# EAGLE design usb (EAGLE 4.16)
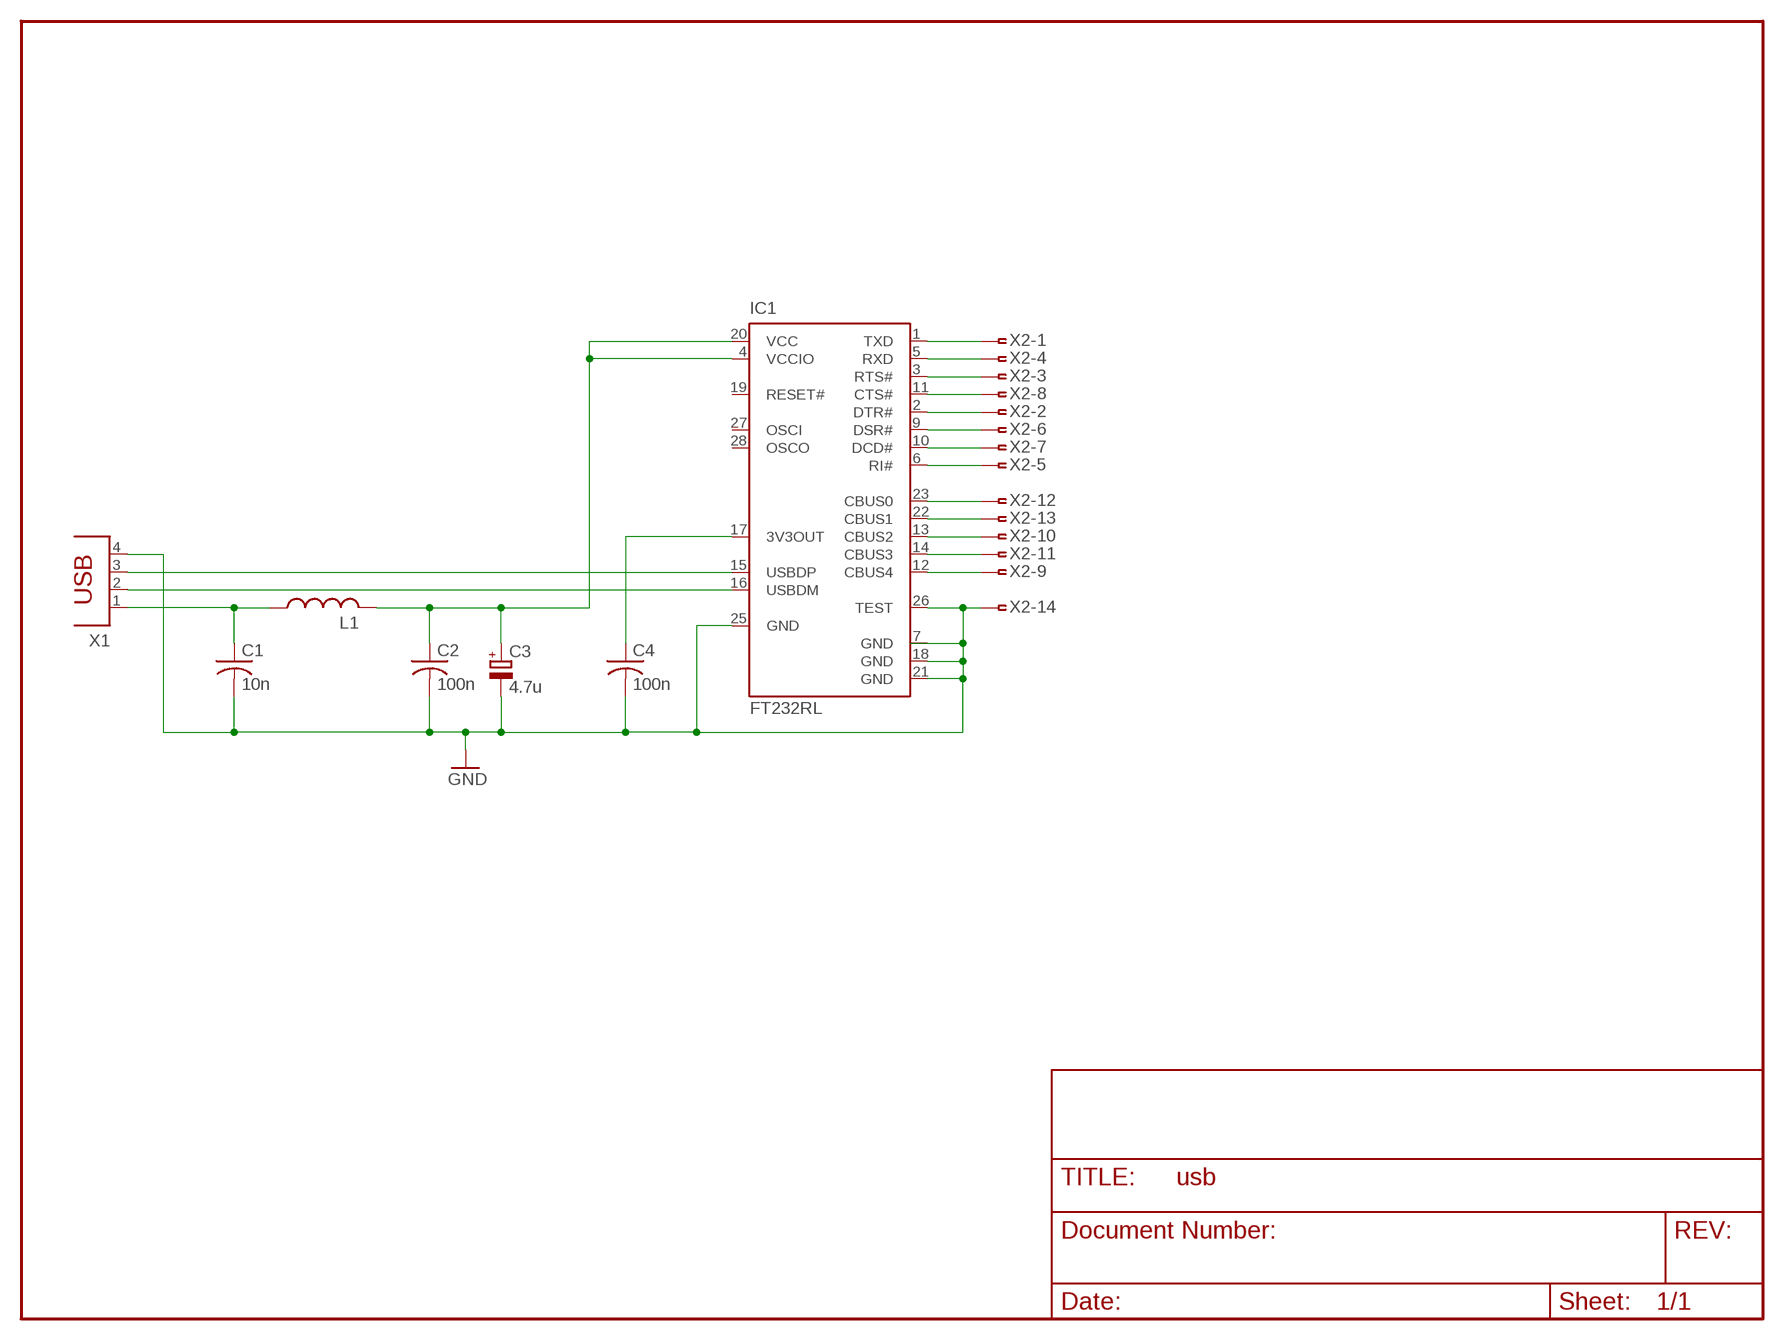
[diagram p0: schematic, sheet 1]

## Parts
C1  10n  C-USC0805  [C0805]
C2  100n  C-USC0805  [C0805]
C3  4.7u  CPOL-EUE2,5-6E  [E2,5-6E]
C4  100n  C-USC0805  [C0805]
IC1  FT232RL  [SSOP28]
L1  L-US0204V  [0204V]
X1  PN87520  [PN87520]
X2  FTOP-14  [FTOP-14]

## Nets
3.3V: C4.1 IC1.17(3V3OUT)
DCD: IC1.10(DCD#) X2.7
DSR: IC1.9(DSR#) X2.6
GND: C1.2 C2.2 C3.- C4.2 IC1.7(GND) IC1.18(GND) IC1.21(GND) IC1.25(GND) IC1.26(TEST) X1.4 X2.14
N$1: IC1.16(USBDM) X1.2
N$2: IC1.15(USBDP) X1.3
N$3: IC1.23(CBUS0) X2.12
N$5: C1.1 L1.1 X1.1
N$7: IC1.22(CBUS1) X2.13
N$8: IC1.13(CBUS2) X2.10
N$9: IC1.14(CBUS3) X2.11
N$10: IC1.12(CBUS4) X2.9
N$11: IC1.11(CTS#) X2.8
N$12: IC1.5(RXD) X2.4
N$13: IC1.6(RI#) X2.5
N$14: IC1.2(DTR#) X2.2
RTS: IC1.3(RTS#) X2.3
TXD: IC1.1(TXD) X2.1
VCC: C2.1 C3.+ IC1.4(VCCIO) IC1.20(VCC) L1.2
Unconnected: IC1.19(RESET#) IC1.27(OSCI) IC1.28(OSCO)

## Library data of the parts
C1 C2 C4 = rcl:C-US: CAPACITOR, American symbol
C3 = rcl:CPOL-EU: POLARIZED CAPACITOR, European symbol
IC1 = ftdichip:FT232R: Source: http://www.ftdichip.com/Documents/DataSheets/DS_FT232R_v104.pdf
L1 = rcl:L-US: INDUCTOR, American symbol
X1 = con-berg:PN87520: BERG USB connector
X2 = con-amp:FTOP-14: AMP connector

## Board
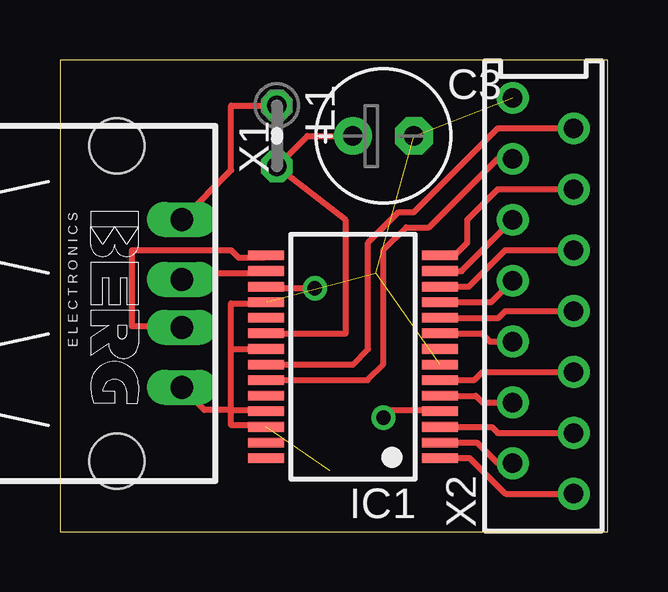
[diagram p1: board, top side]
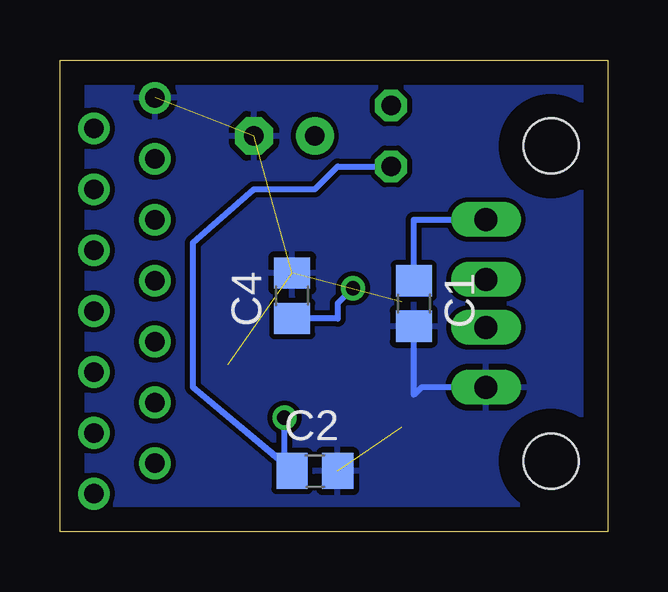
[diagram p2: board, bottom side, seen from below]

Size 22.85 x 19.67 mm. Coordinates in mm from the lower left corner, seen from the top.
Outline: 0,0 22.85,0 22.85,19.67 0,19.67 0,0
Copper layers (1*16): Top 0.035mm / dielectric 1.5mm / Bottom 0.035mm
Design rules "default": minimum track width 10mil, minimum drill 24mil, track to track 8mil, track to pad 8mil, pad to pad 8mil, via to via 8mil, smd to smd 8mil, copper to edge 40mil, drill to drill 8mil, minimum pad ring 10mil, minimum via ring 8mil, stop-mask expansion 4mil, vias tented up to drill 0mil, thermal gap 10mil

### Footprints (pad centres in the part's own frame; a part is rotated, then mirrored left to right if it is on the bottom)
C0805 = smd 1.3 x 1.5: 1 -0.95,0; 2 0.95,0
E2,5-6E = drill 0.813 pad 1.575 round: + -1.27,0 | drill 0.813 pad 1.575 octagon: - 1.27,0
SSOP28 = smd 0.4 x 1.5: 1 -4.225,-3.625; 2 -3.575,-3.625; 3 -2.925,-3.625; 4 -2.275,-3.625; 5 -1.625,-3.625; 6 -0.975,-3.625; 7 -0.325,-3.625; 8 0.325,-3.625; 9 0.975,-3.625; 10 1.625,-3.625; 11 2.275,-3.625; 12 2.925,-3.625; 13 3.575,-3.625; 14 4.225,-3.625; 15 4.225,3.625; 16 3.575,3.625; 17 2.925,3.625; 18 2.275,3.625; 19 1.625,3.625; 20 0.975,3.625; 21 0.325,3.625; 22 -0.325,3.625; 23 -0.975,3.625; 24 -1.625,3.625; 25 -2.275,3.625; 26 -2.925,3.625; 27 -3.575,3.625; 28 -4.225,3.625
0204V = drill 0.813 octagon: 1 -1.27,0; 2 1.27,0
PN87520 = drill 0.95 long: 1 -3.5,2.71; 2 -1,2.71; 3 1,2.71; 4 3.5,2.71 | hole 2.3: -6.57,0; 6.57,0
FTOP-14 = drill 0.813 round: 1 -8.255,-1.27; 2 -6.985,1.27; 3 -5.715,-1.27; 4 -4.445,1.27; 5 -3.175,-1.27; 6 -1.905,1.27; 7 -0.635,-1.27; 8 0.635,1.27; 9 1.905,-1.27; 10 3.175,1.27; 11 4.445,-1.27; 12 5.715,1.27; 13 6.985,-1.27; 14 8.255,1.27

### Placement (x,y rotation side)
C1  8.09,9.52 270 bottom
C2  12.22,2.54 0 bottom
C3  13.49,16.5 0 top
C4  13.17,9.84 90 bottom
IC1  12.22,7.3 90 top
L1  9.04,16.5 270 top
X1  2.38,9.52 270 top
X2  20.16,9.84 90 top

### Tracks (layer width: path | path; a pad name or v marks a point on that pad's centre or on a via)
3.3V  (via drill 0.6)
  Top 0.254: IC1.17 8.66,10.15 v10.63,10.15
  Bottom 0.254: v10.63,10.15 11.27,9.52 11.27,8.88 C4.1
DCD
  Top 0.254: IC1.10 18.29,8.92 18.57,9.2 X2.7
DSR
  Top 0.254: IC1.9 17.59,8.27 17.93,7.93 X2.6
GND  (5 unrouted)
  Top 0.254: 8.64,5.07 8.72,5.07 | 8.64,5.07 IC1.25 | X1.4 6.03,5.07 7.14,5.07 | 7.14,5.07 8.64,5.07 | IC1.26 8.53,4.44 7.14,4.44 7.14,5.07 | IC1.21 8.58,7.62 7.14,7.62 | 7.14,5.07 7.14,7.62 | IC1.18 8.54,9.52 7.14,9.52 7.14,7.62
  Bottom 0.254: C1.2 8.09,5.71 7.77,6.03 X1.4
  pour Bottom: -1.75,-1.27 -1.75,20.63 24.6,20.63 24.6,-1.27
N$1
  Top 0.254: 8.72,10.79 8.68,10.79 | 8.68,10.79 IC1.16 | X1.2 5.35,10.79 8.68,10.79
N$2
  Top 0.254: X1.3 5.04,8.57 3.01,8.57 3.01,11.74 7.14,11.74 7.46,11.43 8.49,11.43 IC1.15
N$3
  Top 0.254: IC1.23 12.83,6.32 13.49,6.98 13.49,11.74 14.44,12.7 15.39,12.7 18.25,15.55 X2.12
N$5
  Top 0.254: X1.1 7.14,15.07 7.14,17.78 L1.1
  Bottom 0.254: C1.1 8.09,13.01 X1.1 | X1.1 4.92,13.01 | X1.1
N$7
  Top 0.254: IC1.22 12.21,6.97 12.85,7.62 12.85,12.06 14.12,13.33 14.76,13.33 18.25,16.82 X2.13
N$8
  Top 0.254: IC1.13 16.75,10.87 X2.10
N$9
  Top 0.254: IC1.14 16.44,11.52 16.98,12.06 16.98,13.01 18.25,14.28 X2.11
N$10
  Top 0.254: IC1.12 17.05,10.22 18.57,11.74 X2.9
N$11
  Top 0.254: IC1.11 17.98,9.57 X2.8
N$12
  Top 0.254: IC1.5 17.34,5.67 17.61,5.39 X2.4
N$13
  Top 0.254: IC1.6 17.27,6.32 17.61,6.66 X2.5
N$14
  Top 0.254: IC1.2 17.38,3.72 18.25,2.85 X2.2
RTS
  Top 0.254: IC1.3 18,4.37 18.25,4.12 X2.3
TXD
  Top 0.254: IC1.1 17.08,3.07 18.57,1.58 X2.1
VCC  (via drill 0.6)
  Top 0.254: C3.+ 10.31,16.51 L1.2 11.9,13.01 11.9,8.25 8.57,8.25 | 8.57,8.25 8.41,8.25 | 8.57,8.25 IC1.20 | 15.89,5.07 16.03,5.07 | 15.89,5.07 IC1.4 | v13.49,4.76 13.8,5.07 15.89,5.07
  Bottom 0.254: 17.3,6.03 13.49,2.86 C2.1 17.3,6.03 | 17.3,6.03 13.49,2.85 v13.49,4.76 | 17.3,6.03 17.3,12.06 14.76,14.28 12.22,14.28 11.27,15.23 L1.2